# EAGLE schematic operator_mk3_build_03062015_rev9_dirtyPCB (EAGLE 7.1.0)
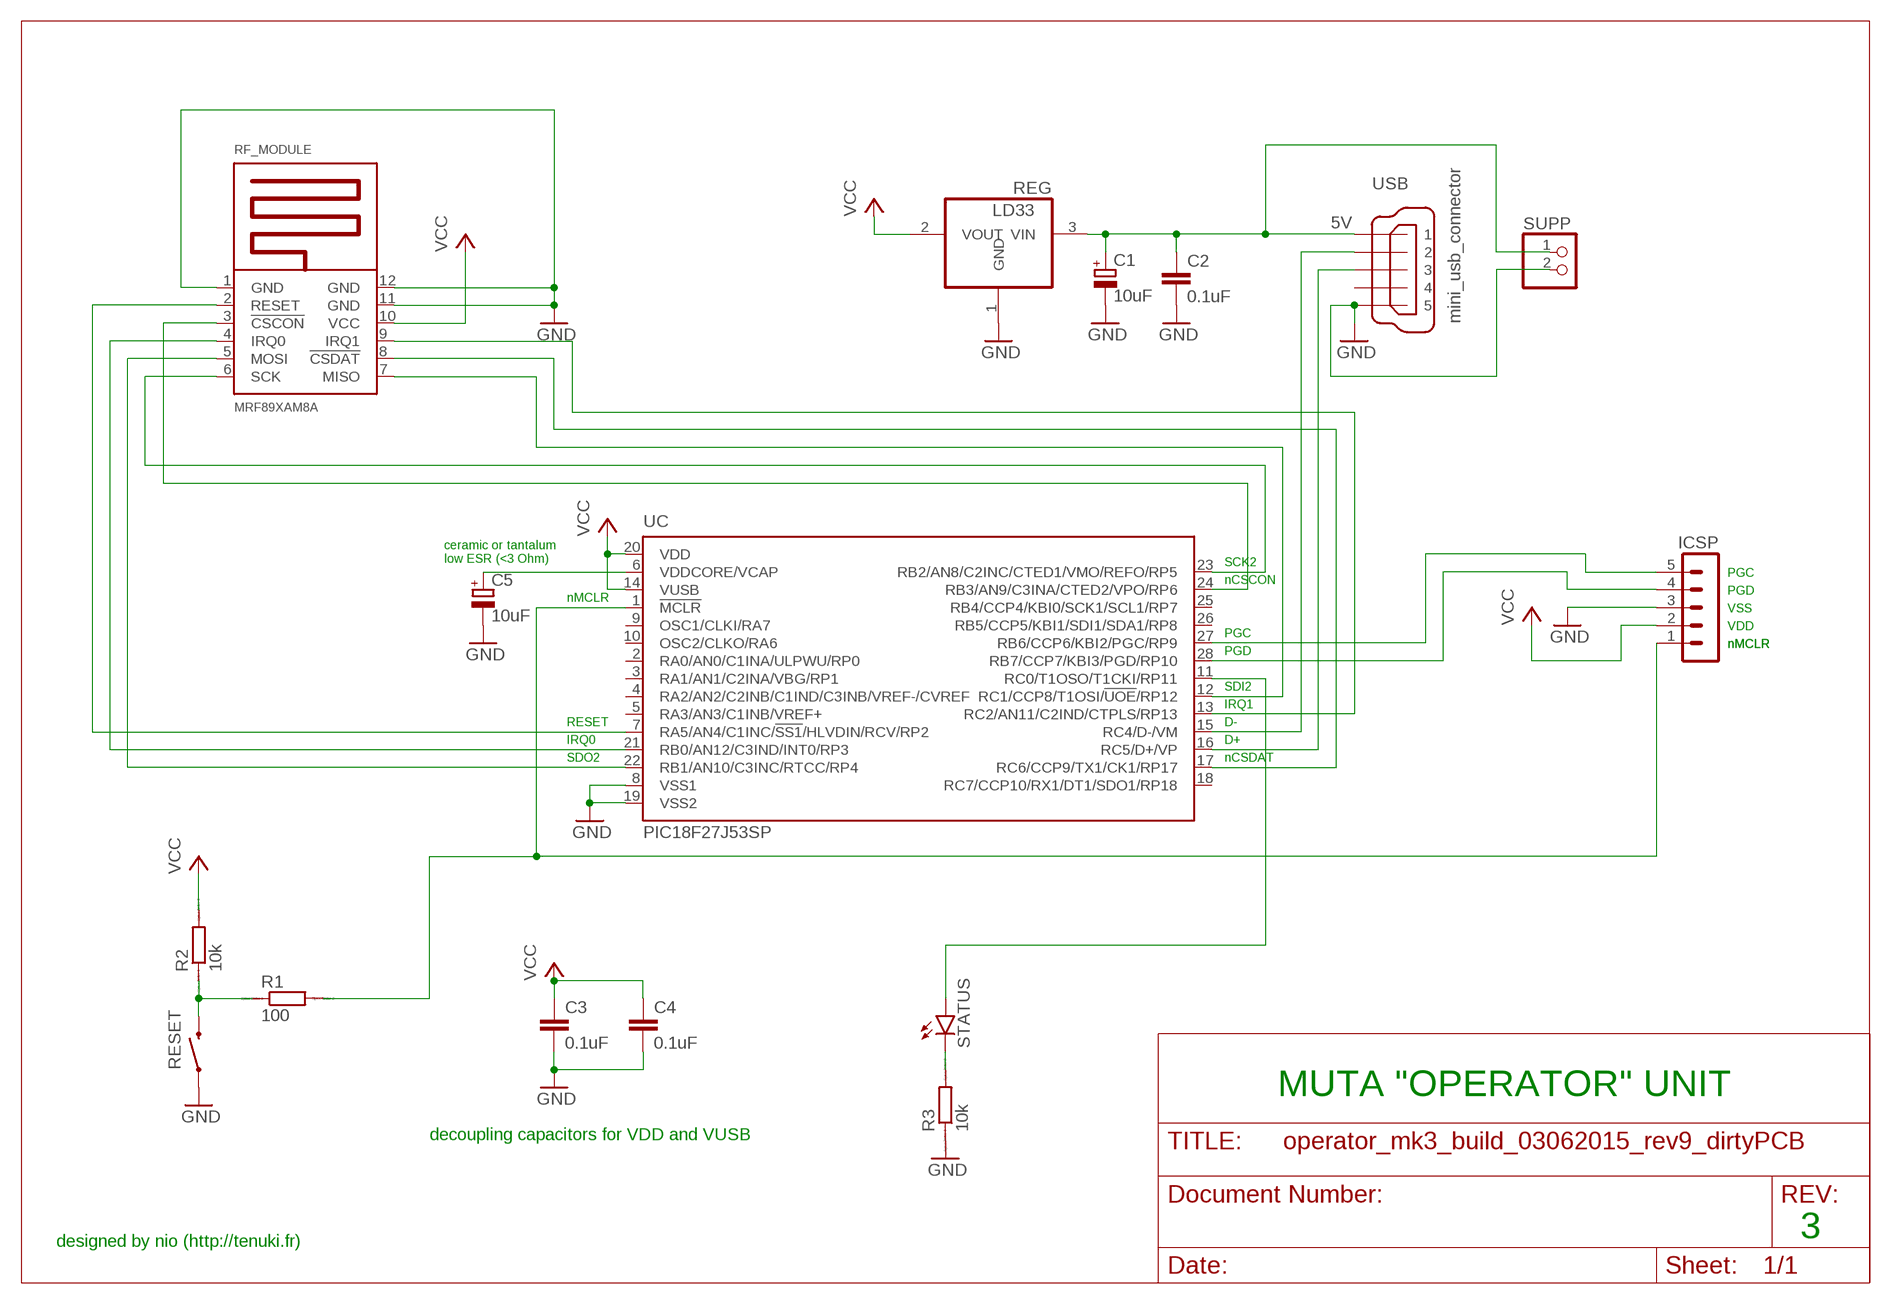
[diagram p0: schematic, sheet 1]

## Parts
C1  10uF  CPOL-EUTT6D6  [TT5D6]
C2  0.1uF  C-EU050-025X075  [C050-025X075]
C3  0.1uF  C-EU050-025X075  [C050-025X075]
C4  0.1uF  C-EU050-025X075  [C050-025X075]
C5  10uF  CPOL-EUC/6032-28R  [C/6032-28R]
ICSP  MA05-1  [MA05-1]
R1  100  R-EU_0207_10  [0207/10]
R2  10k  R-EU_0207_10  [0207/10]
R3  10k  R-EU_0207_2V  [0207/2V]
REG  LD33  REG1117  [SOT223]
RESET  SWITCH-MOMENTARY-2PTH  [TACTILE-PTH]
RF_MODULE  MRF89XAM8A  [MRF89XAMXA]
STATUS  LED5MM  [LED5MM]
SUPP  PINHD-1X2  [1X02]
UC  PIC18F27J53SP  [DIL28-3]
USB  mini_usb_connector  MINI-USB-UX60-MB-5ST  [UX60-MB-5ST]

## Nets
5V: C1.+ C2.1 REG.3(VIN) SUPP.1 USB.1
GND: C1.- C2.2 C3.2 C4.2 C5.- ICSP.3 R3.1 REG.1(GND) RESET.1 RF_MODULE.1(GND) RF_MODULE.11(GND) RF_MODULE.12(GND) SUPP.2 UC.8(VSS1) UC.19(VSS2) USB.5
N$1: UC.15(RC4/D-/VM) USB.2
N$2: UC.16(RC5/D+/VP) USB.3
N$3: ICSP.1 R1.2 UC.1(!MCLR)
N$4: C5.+ UC.6(VDDCORE/VCAP)
N$5: R1.1 R2.1 RESET.3
N$6: ICSP.4 UC.28(RB7/CCP7/KBI3/PGD/RP10)
N$7: ICSP.5 UC.27(RB6/CCP6/KBI2/PGC/RP9)
N$9: RF_MODULE.2(RESET) UC.7(RA5/AN4/C1INC/!SS1!/HLVDIN/RCV/RP2)
N$10: RF_MODULE.6(SCK) UC.23(RB2/AN8/C2INC/CTED1/VMO/REFO/RP5)
N$14: R3.2 STATUS.K(C)
N$15: STATUS.A UC.11(RC0/T1OSO/T1CKI/RP11)
N$19: RF_MODULE.7(MISO) UC.12(RC1/CCP8/T1OSI/!UOE!/RP12)
N$21: RF_MODULE.3(!CSCON) UC.24(RB3/AN9/C3INA/CTED2/VPO/RP6)
N$22: RF_MODULE.5(MOSI) UC.22(RB1/AN10/C3INC/RTCC/RP4)
N$23: RF_MODULE.4(IRQ0) UC.21(RB0/AN12/C3IND/INT0/RP3)
N$24: RF_MODULE.9(IRQ1) UC.13(RC2/AN11/C2IND/CTPLS/RP13)
N$25: RF_MODULE.8(!CSDAT) UC.17(RC6/CCP9/TX1/CK1/RP17)
VCC: C3.1 C4.1 ICSP.2 R2.2 REG.2(VOUT) RF_MODULE.10(VCC) UC.14(VUSB) UC.20(VDD)
Unconnected: UC.2(RA0/AN0/C1INA/ULPWU/RP0) UC.3(RA1/AN1/C2INA/VBG/RP1) UC.4(RA2/AN2/C2INB/C1IND/C3INB/VREF-/CVREF) UC.5(RA3/AN3/C1INB/VREF+) UC.9(OSC1/CLKI/RA7) UC.10(OSC2/CLKO/RA6) UC.18(RC7/CCP10/RX1/DT1/SDO1/RP18) UC.25(RB4/CCP4/KBI0/SCK1/SCL1/RP7) UC.26(RB5/CCP5/KBI1/SDI1/SDA1/RP8) USB.4

## Notes on the sheet
- ceramic or tantalum
  low ESR (<3 Ohm)
- SCK2
- PGC
- nCSCON
- PGD
- nMCLR
- VSS
- VDD
- PGC
- nMCLR | nMCLR
- PGD
- SDI2
- IRQ1
- RESET | D-
- IRQ0 | D+
- SDO2 | nCSDAT
- MUTA "OPERATOR" UNIT
- decoupling capacitors for VDD and VUSB
- 3
- designed by nio (http://tenuki.fr)

## Library data of the parts
C1 C5 = resistor:CPOL-EU: POLARIZED CAPACITOR, European symbol
C2-C4 = rcl:C-EU: CAPACITOR, European symbol
ICSP = con-lstb:MA05-1: PIN HEADER; OC_FARNELL: unknown; OC_NEWARK: unknown
R1-R3 = resistor:R-EU_: RESISTOR, European symbol; SPICEPREFIX: R
REG = burr-brown:REG1117: 800mA and 1A Low Dropout (LDO) Positive Regulator 1.8V, 2.5V, 2.85V, 3.3V, 5V, and Adj; MPN: LD33; OC_FARNELL: 1097566; OC_NEWARK: 14P6981
RESET = SparkFun-Electromechanical:SWITCH-MOMENTARY-2: Various NO switches- pushbuttons, reed, etc
RF_MODULE = microchip2:MRF89XAM8A: Microchip MRF89XAM8A 868MHz Module
STATUS = SparkFun-LED:LED: LEDs Standard schematic elements and footprints for 5mm, 3mm, 1206, and 0603 sized LEDs. 5mm - Spark Fun Electronics SKU : COM-00529 (and others)
SUPP = pinhead:PINHD-1X2: PIN HEADER
UC = microchip:PIC18F2*J53: PIC18F47J53 Family High-Performance USB Microcontrollers with nanoWatt XLP Technology Source: Data sheet <http://ww1.microchip.com/downloads/en/DeviceDoc/39964B.pdf>; MPN: PIC18F27J53-I/SP; OC_FARNELL: unknown; OC_NEWARK: 63R7839
USB = con-hirose:MINI-USB-: MINI USB Connector Source: http://www.hirose.co.jp/cataloge_hp/e24000019.pdf; OC_FARNELL: unknown; OC_NEWARK: unknown